# Altium schematic sheet mainSheet.SchDoc
size A4
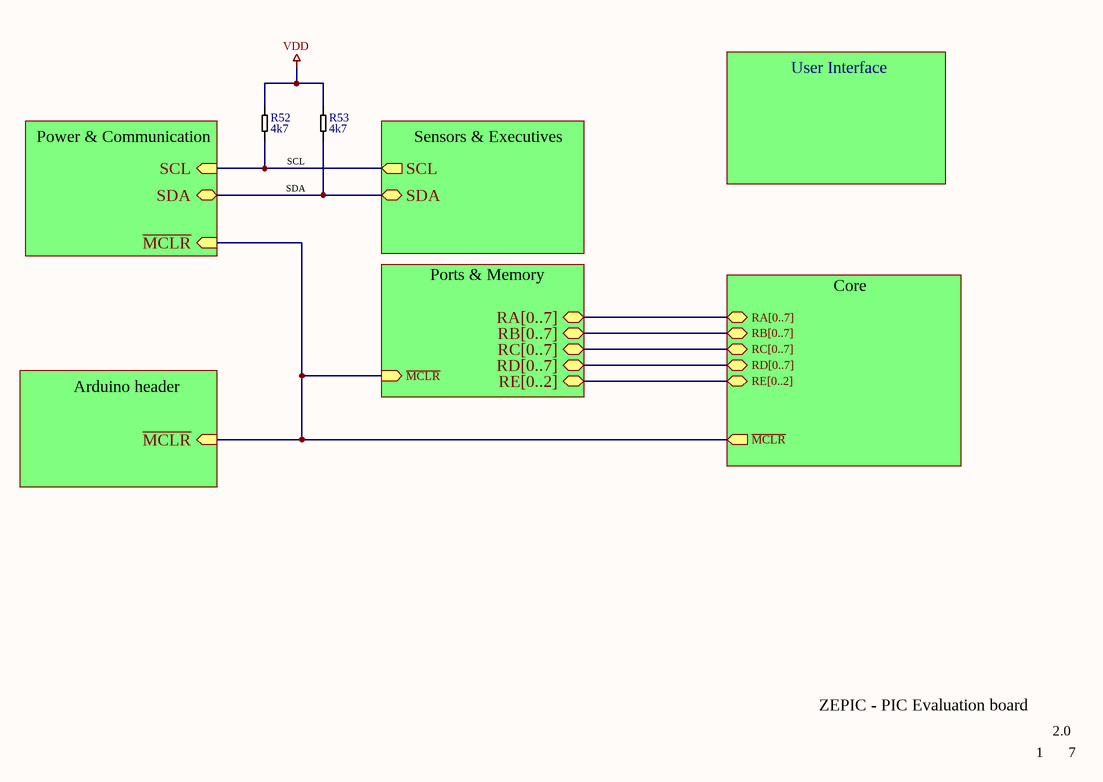
[diagram p0: mainSheet.SchDoc]

## Parts
R52  Resistance: 4k7  [0805]  (hidden comment: Resistor)
R53  Resistance: 4k7  [0805]  (hidden comment: Resistor)

## Sub-sheets
Arduino header = arduinoHeader.SchDoc: ~{MCLR} (in)
Core = core.SchDoc: ~{MCLR} (out), RE[0..2] (bidir), RD[0..7] (bidir), RC[0..7] (bidir), RB[0..7] (bidir), RA[0..7] (bidir)
Ports & Memory = portsAndMemory.SchDoc: RE[0..2] (bidir), RD[0..7] (bidir), RC[0..7] (bidir), RB[0..7] (bidir), RA[0..7] (bidir), ~{MCLR} (in)
Power & Communication = powerAndCommunication.SchDoc: ~{MCLR} (in), SCL (in), SDA (bidir)
Sensors & Executives = sensorsAndExecutiveElements.SchDoc: SCL (out), SDA (bidir)
User Interface = userInterface.SchDoc: no entries

## Nets
VDD: R52.1 R53.1
SCL: R52.2 ; sheet Power & Communication/SCL, sheet Sensors & Executives/SCL
SDA: R53.2 ; sheet Power & Communication/SDA, sheet Sensors & Executives/SDA
(unnamed): sheet Power & Communication/~{MCLR}, sheet Core/~{MCLR}, sheet Arduino header/~{MCLR}, sheet Ports & Memory/~{MCLR}

## Buses and harness runs
bus sheet Core/RA[0..7] = sheet Ports & Memory/RA[0..7]
bus sheet Core/RB[0..7] = sheet Ports & Memory/RB[0..7]
bus sheet Core/RC[0..7] = sheet Ports & Memory/RC[0..7]
bus sheet Core/RD[0..7] = sheet Ports & Memory/RD[0..7]
bus sheet Core/RE[0..2] = sheet Ports & Memory/RE[0..2]

## Notes on the sheet
- ZEPIC - PIC Evaluation board
- 1
- 2.0
- 7
- Title:
- Size:
- Date:
- A4
- Number:
- Time:
- Revision:
- Sheet
- of
- Author:
- Krzysztof Pierczyk
- File:

## Library data of the parts
R52 R53 = Resistor: Nominal power: 125mW